# EAGLE design tvbgone (EAGLE 5.11)
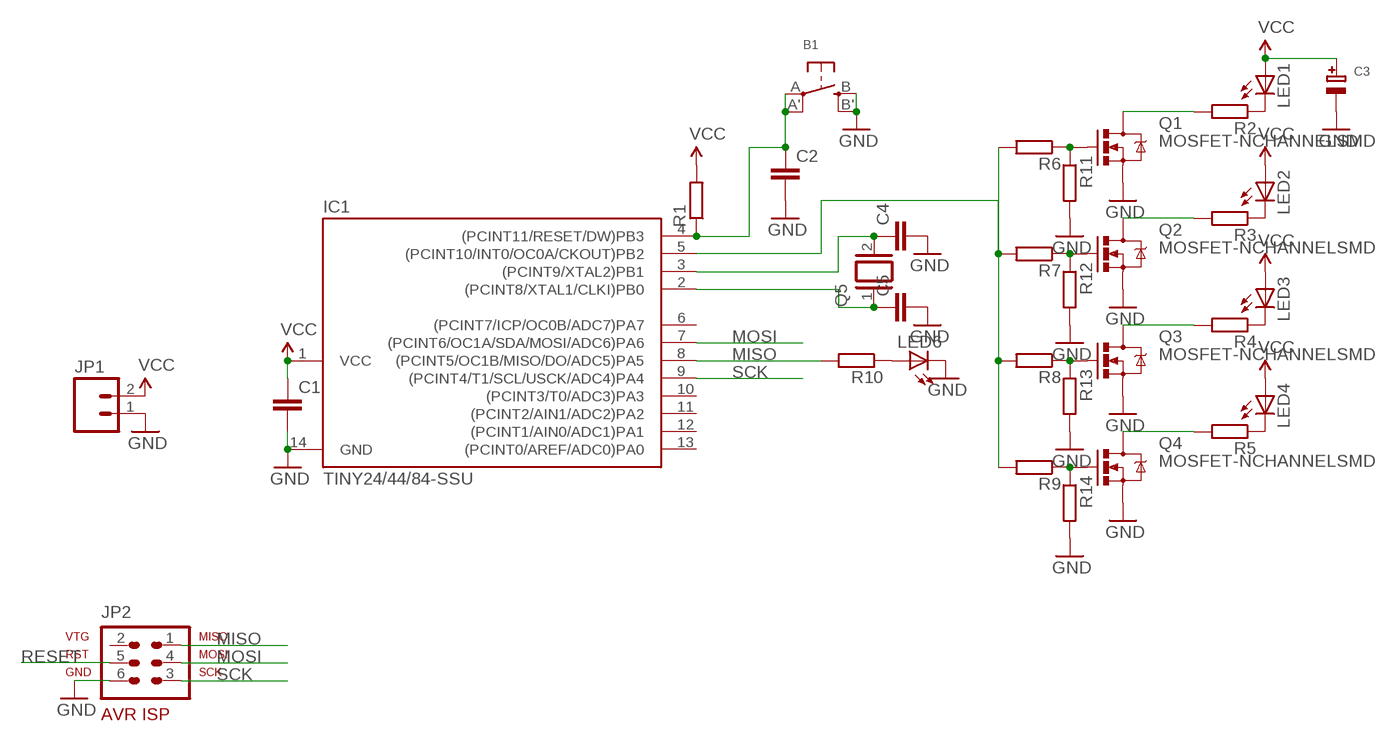
[diagram p0: schematic, sheet 1]

## Parts
B1  SWITCH_TACT_SMT  [EVQ-Q2]
C1  C-EUC0603  [C0603]
C2  C-EUC0603  [C0603]
C3  CAP_TANTALUMD/7343_WAVE  [EIA7343-31/D-W]
C4  C-EUC0805  [C0805]
C5  C-EUC0805  [C0805]
IC1  TINY24/44/84-SSU  [SOIC14]
JP1  M02PTH3  [1X02_LONGPADS]
JP2  AVR-ISP-6  [AVR-ISP-6]
LED1  LED5MM  [LED5MM]
LED2  LED5MM  [LED5MM]
LED3  LED5MM  [LED5MM]
LED4  LED5MM  [LED5MM]
LED6  LEDCHIPLED_0805  [CHIPLED_0805]
Q1  MOSFET-NCHANNELSMD  [SOT23-3]
Q2  MOSFET-NCHANNELSMD  [SOT23-3]
Q3  MOSFET-NCHANNELSMD  [SOT23-3]
Q4  MOSFET-NCHANNELSMD  [SOT23-3]
Q5  XTAL/S  [QS]
R1  R-EU_R0603  [R0603]
R2  R-EU_R0805  [R0805]
R3  R-EU_R0805  [R0805]
R4  R-EU_R0805  [R0805]
R5  R-EU_R0805  [R0805]
R6  R-EU_R0805  [R0805]
R7  R-EU_R0805  [R0805]
R8  R-EU_R0805  [R0805]
R9  R-EU_R0805  [R0805]
R10  R-EU_R0805  [R0805]
R11  R-EU_R0805  [R0805]
R12  R-EU_R0805  [R0805]
R13  R-EU_R0805  [R0805]
R14  R-EU_R0805  [R0805]

## Nets
GND: B1.B'(S1) B1.B(S) C1.2 C2.2 C3.- C4.2 C5.2 IC1.14(GND) JP1.1 JP2.6 LED6.C Q1.2(S) Q2.2(S) Q3.2(S) Q4.2(S) R11.2 R12.2 R13.2 R14.2
MISO: IC1.8((PCINT5/OC1B/MISO/DO/ADC5)PA5) JP2.1 R10.2
MOSI: IC1.7((PCINT6/OC1A/SDA/MOSI/ADC6)PA6) JP2.4
N$1: LED1.K(C) R2.1
N$2: LED2.K(C) R3.1
N$3: LED3.K(C) R4.1
N$4: LED4.K(C) R5.1
N$5: Q1.1(G) R6.1 R11.1
N$6: Q2.1(G) R7.1 R12.1
N$7: Q3.1(G) R8.1 R13.1
N$8: Q4.1(G) R9.1 R14.1
N$9: Q1.3(D) R2.2
N$10: Q2.3(D) R3.2
N$11: Q3.3(D) R4.2
N$12: Q4.3(D) R5.2
N$13: IC1.5((PCINT10/INT0/OC0A/CKOUT)PB2) R6.2 R7.2 R8.2 R9.2
N$14: LED6.A R10.1
N$15: C4.1 IC1.3((PCINT9/XTAL2)PB1) Q5.2
N$16: C5.1 IC1.2((PCINT8/XTAL1/CLKI)PB0) Q5.1
RESET: B1.A'(P1) B1.A(P) C2.1 IC1.4((PCINT11/RESET/DW)PB3) JP2.5 R1.1
SCK: IC1.9((PCINT4/T1/SCL/USCK/ADC4)PA4) JP2.3
VCC: C1.1 C3.+ IC1.1(VCC) JP1.2 LED1.A LED2.A LED3.A LED4.A R1.2
Unconnected: IC1.6((PCINT7/ICP/OC0B/ADC7)PA7) IC1.10((PCINT3/T0/ADC3)PA3) IC1.11((PCINT2/AIN1/ADC2)PA2) IC1.12((PCINT1/AIN0/ADC1)PA1) IC1.13((PCINT0/AREF/ADC0)PA0) JP2.2

## Library data of the parts
B1 = microbuilder:SWITCH_TACT_SMT: SMT Tact Switches 6x6mm - Digikey: P12940SCT-ND KMR2 (4.6x2.8mm) - Digikey: 401-1426-1-ND EVQ-PQHB55 - Light Touch, 160GF (4.5x4.5mm) - Digikey: P8090SCT-ND
C1 C2 C4 C5 = rcl:C-EU: CAPACITOR, European symbol
C3 = microbuilder:CAP_TANTALUM: Tantalum Capacitors Wave footprints have larger pads and are meant to be used for hand soldering. Reflow footprints are optimised for solder paste and a reflow oven. EIA3216-18/A-[R/W] - Size A / 3216-18 / 1206 footprint 4.7µF 25V 10% Tantalum Capacitor 10µF 16V 10% Tantalum Capacitor [Digikey: 495-2236-2-ND] EIA3528-21/B-[R/W] - Size B / 3528-21 47µF 10V 10% Tantalum Capactior [Digikey: 495-2216-1-ND] EIA6032-28/C-[R/W] - Size C / 6032-28 10µF 35V 20% Tantalum Capacitor [Digikey: 495-2285-1-ND] 100µF 16V 10% Tantalum Capactior [Digikey: 399-5214-1-ND]
IC1 = avr-7:TINY24/44/84
JP1 = SparkFun:M02: Header 2 Standard 2-pin 0.1" header. Use with straight break away headers (SKU : PRT-00116), right angle break away headers (PRT-00553), swiss pins (PRT-00743), machine pins (PRT-00117), and female headers (PRT-00115). Molex polarized connector foot print use with SKU : PRT-08233 with associated crimp pins and housings.
JP2 = avr-5:AVR-ISP-6: AVR ISP-6 Serial Programming Header
LED1-LED4 = SparkFun:LED: LEDs Standard schematic elements and footprints for 5mm, 3mm, 1206, and 0603 sized LEDs. 5mm - Spark Fun Electronics SKU : COM-00529 (and others)
LED6 = adafruit:LED: LED OSRAM: - CHIPLED LG R971, LG N971, LY N971, LG Q971, LY Q971, LO R971, LY R971 LH N974, LH R974 LS Q976, LO Q976, LY Q976 LO Q996 - Hyper CHIPLED LW Q18S LB Q993, LB Q99A, LB R99A - SideLED LS A670, LO A670, LY A670, LG A670, LP A670 LB A673, LV A673, LT A673, LW A673 LH A674 LY A675 LS A676, LA A676, LO A676, LY A676, LW A676 LS A679, LY A679, LG A679 - Hyper Micro SIDELED® LS Y876, LA Y876, LO Y876, LY Y876 LT Y87S - SmartLED LW L88C, LW L88S LB L89C, LB L89S, LG L890 LS L89K, LO L89K, LY L89K LS L896, LA L896, LO L896, LY L896 - TOPLED LS T670, LO T670, LY T670, LG T670, LP T670 LSG T670, LSP T670, LSY T670, LOP T670, LYG T670 LG T671, LOG T671, LSG T671 LB T673, LV T673, LT T673, LW T673 LH T674 LS T676, LA T676, LO T676, LY T676, LB T676, LH T676, LSB T676, LW T676 LB T67C, LV T67C, LT T67C, LS T67K, LO T67K, LY T67K, LW E67C LS E67B, LA E67B, LO E67B, LY E67B, LB E67C, LV E67C, LT E67C LW T67C LS T679, LY T679, LG T679 LS T770, LO T770, LY T770, LG T770, LP T770 LB T773, LV T773, LT T773, LW T773 LH T774 LS E675, LA E675, LY E675, LS T675 LS T776, LA T776, LO T776, LY T776, LB T776 LHGB T686 LT T68C, LB T68C - Hyper Mini TOPLED® LB M676 - Mini TOPLED Santana® LG M470 LS M47K, LO M47K, LY M47K Source: http://www.osram.convergy.de/
Q1-Q4 = SparkFun:MOSFET-NCHANNEL
Q5 = special:XTAL/S: CRYSTAL
R1-R14 = rcl:R-EU_: RESISTOR, European symbol

## Board
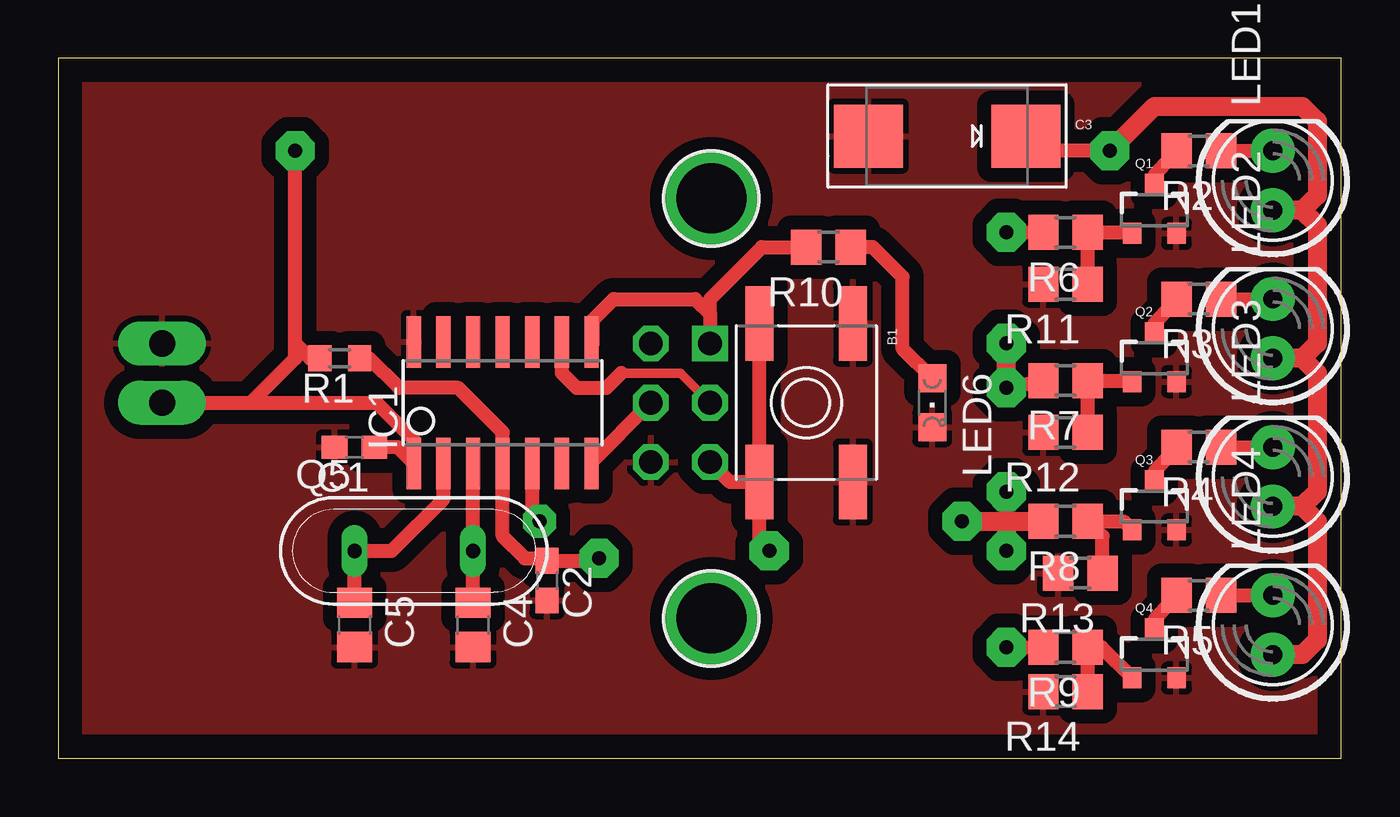
[diagram p1: board, top side]
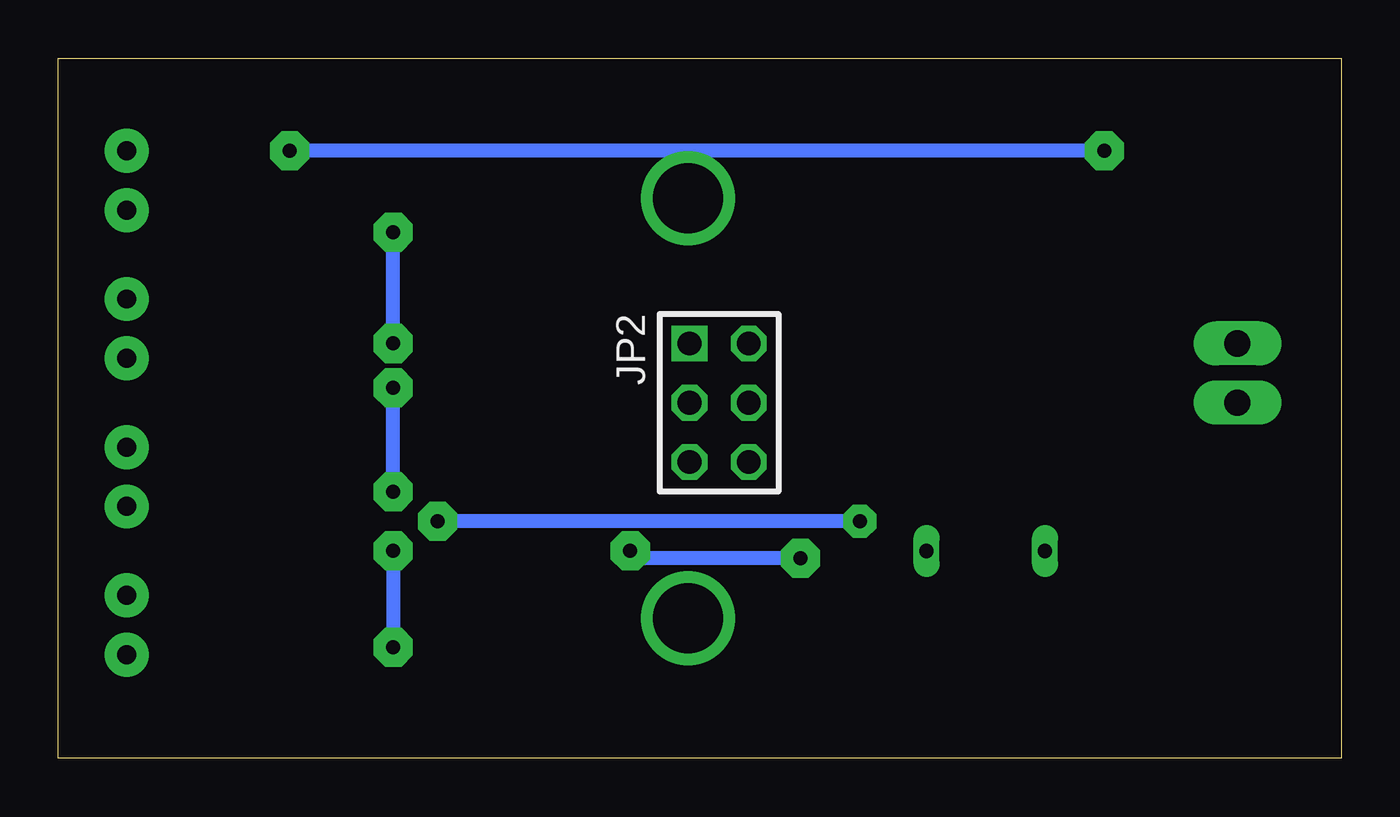
[diagram p2: board, bottom side, seen from below]

Size 55 x 30 mm. Coordinates in mm from the lower left corner, seen from the top.
Outline: 0,0 55,0 55,30 0,30 0,0
Copper layers (1*16): Top 0.035mm / dielectric 1.5mm / Bottom 0.035mm
Design rules "default": minimum track width 10mil, minimum drill 24mil, track to track 8mil, track to pad 8mil, pad to pad 8mil, via to via 8mil, smd to smd 8mil, copper to edge 40mil, drill to drill 8mil, minimum pad ring 10mil, minimum via ring 8mil, stop-mask expansion 4mil, vias tented up to drill 0mil, thermal gap 10mil

### Footprints (pad centres in the part's own frame; a part is rotated, then mirrored left to right if it is on the bottom)
EVQ-Q2 = smd 3.2 x 1.2: A -3.4,-2; A' 3.4,-2; B -3.4,2; B' 3.4,2
C0603 = smd 1.1 x 1: 1 -0.85,0; 2 0.85,0
EIA7343-31/D-W = smd 2.95 x 2.7: + 3.375,0; - -3.375,0
C0805 = smd 1.3 x 1.5: 1 -0.95,0; 2 0.95,0
SOIC14 = smd 0.61 x 2.21: 1 -3.81,-2.603; 2 -2.54,-2.603; 3 -1.27,-2.603; 4 0,-2.603; 5 1.27,-2.603; 6 2.54,-2.603; 7 3.81,-2.603; 8 3.81,2.603; 9 2.54,2.603; 10 1.27,2.603; 11 0,2.603; 12 -1.27,2.603; 13 -2.54,2.603; 14 -3.81,2.603
1X02_LONGPADS = drill 1.118 pad 1.88 long: 1 0,0; 2 2.54,0
AVR-ISP-6 = drill 1.016 square: 1 -2.54,-1.27 | drill 1.016 octagon: 2 -2.54,1.27; 3 0,-1.27; 4 0,1.27; 5 2.54,-1.27; 6 2.54,1.27
LED5MM = drill 0.813 pad 1.88 round: A -1.27,0; K 1.27,0
CHIPLED_0805 = smd 1.2 x 1.2: A 0,-1.05; C 0,1.05
SOT23-3 = smd 0.8 x 0.9: 1 -0.95,-1; 2 0.95,-1; 3 0,1.1
QS = drill 0.61 long: 1 -2.54,0; 2 2.54,0
R0603 = smd 1 x 1.1: 1 -0.85,0; 2 0.85,0
R0805 = smd 1.3 x 1.5: 1 -0.95,0; 2 0.95,0
MOUNTINGHOLE_3.0_PLATEDTHIN = drill 3 pad 3.6 round: P$1 0,0

### Placement (x,y rotation side)
B1  32.07,15.24 270 top
C1  12.7,13.34 180 top
C2  20.95,7.62 270 top
C3  38.1,26.67 0 top
C4  17.78,5.71 270 top
C5  12.7,5.71 270 top
IC1  19.05,15.24 0 top
JP1  4.45,17.78 270 top
JP2  26.67,15.24 270 bottom
LED1  52.07,24.77 90 top
LED2  52.07,18.41 90 top
LED3  52.07,12.06 90 top
LED4  52.07,5.71 90 top
LED6  37.47,15.24 180 top
Q1  46.99,23.5 0 top
Q2  46.99,17.14 0 top
Q3  46.99,10.79 0 top
Q4  46.99,4.45 0 top
Q5  15.24,8.89 0 top
R1  12.06,17.14 180 top
R2  48.9,26.04 180 top
R3  48.9,19.68 180 top
R4  48.9,13.34 180 top
R5  48.9,6.99 180 top
R6  43.18,22.54 180 top
R7  43.18,16.19 180 top
R8  43.18,10.16 180 top
R9  43.18,4.76 180 top
R10  33.02,21.91 180 top
R11  43.18,20.32 180 top
R12  43.18,13.97 180 top
R13  43.81,7.94 180 top
R14  43.18,2.86 180 top
U$1  [MOUNTINGHOLE_3.0_PLATEDTHIN]  28,6 0 top
U$2  [MOUNTINGHOLE_3.0_PLATEDTHIN]  28,24 0 top

### Tracks (layer width: path | path; a pad name or v marks a point on that pad's centre or on a via)
GND
  pour Top (isolate 0.61): 0,30.48 0,0 54.61,0 54.61,30.48
MISO
  Top 0.61: IC1.8 22.92,17.78 22.92,18.8 23.81,19.68 27.3,19.68 27.94,19.05 | 27.94,19.05 JP2.1 | 27.94,19.05 27.94,19.68 30.16,21.91 R10.2
MOSI
  Top 0.61: IC1.7 22.86,12.7 JP2.4
N$1
  Top 0.61: R2.1 LED1.K
N$2
  Top 0.61: R3.1 LED2.K
N$3
  Top 0.61: R4.1 LED3.K
N$4
  Top 0.61: R5.1 LED4.K
N$5
  Top 0.61: Q1.1 45.99,22.54 R6.1 R11.1
N$6
  Top 0.61: Q2.1 45.99,16.19 R7.1 R12.1
N$7
  Top 0.61: Q3.1 45.67,10.16 R8.1 44.77,9.53 R13.1
N$8
  Top 0.61: R14.1 R9.1 44.72,4.76 Q4.1
N$9
  Top 0.61: R2.2 46.99,24.98 Q1.3
N$10
  Top 0.61: R3.2 46.99,18.63 Q2.3
N$11
  Top 0.61: R4.2 46.99,12.28 Q3.3
N$12
  Top 0.61: R5.2 46.99,5.93 Q4.3
N$13  (via drill 0.6 pad 1.42, 0.6 pad 1.68)
  Top 0.61: v40.64,4.76 R9.2 | v40.64,15.88 R7.2 | 40.64,10.16 v40.64,11.43 | v40.64,22.54 R6.2 | IC1.5 20.32,10.48 v20.64,10.16
  Top 0.813: v38.73,10.16 40.64,10.16 | 40.64,10.16 R8.2 | 40.64,10.16 v40.64,8.89 | v40.64,15.88 v40.64,17.78
  Bottom 0.61: v20.64,10.16 v38.73,10.16 | v40.64,8.89 v40.64,4.76 | v40.64,11.43 v40.64,15.88 | v40.64,17.78 v40.64,22.54
N$14
  Top 0.61: LED6.A 36.2,17.56 36.2,20.64 34.92,21.91 R10.1
N$15
  Top 0.61: IC1.3 Q5.2 C4.1
N$16
  Top 0.61: IC1.2 16.51,11.11 14.29,8.89 Q5.1 C5.1
RESET  (via drill 0.6 pad 1.68)
  Top 0.61: IC1.4 19.05,11.21 | IC1.4 19.05,9.53 20,8.57 20.85,8.57 C2.1 23.07,8.47 v23.18,8.57 | R1.1 13.34,17.14 14.61,15.88 17.14,15.88 19.05,13.97 IC1.4 | B1.A' B1.A | B1.A' 28.8,11.84 JP2.5 | v30.48,8.89 30.07,9.3 B1.A'
  Bottom 0.61: v23.18,8.57 30.16,8.57 v30.48,8.89
SCK
  Top 0.406: 24.13,16.51 26.67,16.51 JP2.3
  Top 0.61: IC1.9 21.59,16.51 22.23,15.88 23.5,15.88 24.13,16.51
VCC  (via drill 0.6 pad 1.68)
  Top 0.61: C1.1 14.54,13.34 IC1.1 15.24,13.65 13.65,15.24 8.26,15.24 | JP1.2 8.26,15.24 | 10.16,17.78 10.16,17.14 8.26,15.24 | 10.16,17.78 v10.16,26.04 | v45.09,26.04 42.11,26.04 C3.+ | R1.2 10.79,17.14 10.16,17.78
  Top 0.813: 53.34,23.5 53.98,22.86 53.98,17.78 53.34,17.14 | 53.34,17.14 LED2.A | 53.34,10.79 LED3.A | 53.34,10.79 53.98,11.43 53.98,16.51 53.34,17.14 | LED4.A 53.34,4.45 53.98,5.08 53.98,10.16 53.34,10.79 | v45.09,26.04 46.99,27.94 53.34,27.94 53.98,27.3 53.98,24.13 53.34,23.5 | 53.34,23.5 LED1.A
  Bottom 0.61: v10.16,26.04 v45.09,26.04